# Altium schematic sheet KEY1.SchDoc
size A4
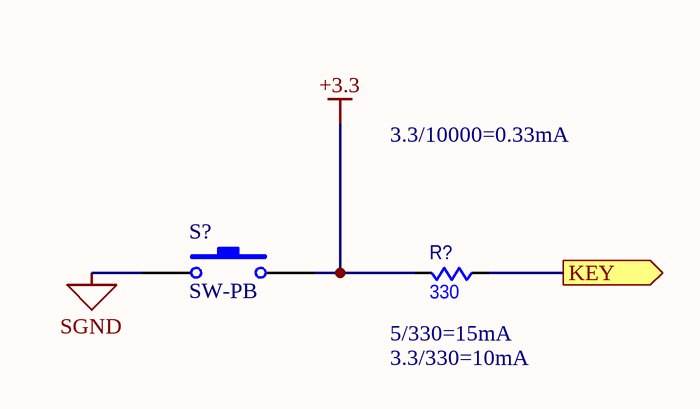
[diagram p0: KEY1.SchDoc]

## Parts
R?  value 330  [0603]  (hidden comment: Res)
S?  SW-PB  [SW_PB2_A1]

## Ports
KEY (out)

## Nets
+3.3: R?.2 S?.2
SGND: S?.1
KEY: R?.1 ; port KEY

## Notes on the sheet
- 3.3/10000=0.33mA
- (near R?) 5/330=15mA
- (near R?) 3.3/330=10mA

## Library data of the parts
R? = Res: 常规电阻
S? = SW-PB: 微动开关; Published: 24-Mar-1999; LatestRevisionDate: 17-Jul-2002; LatestRevisionNote: Re-released for DXP Platform.; PackageReference: SPST-2; Publisher: Altium Limited